# Altium schematic sheet unifying_sht1.SchDoc
size 209 x 297 mm; CheckedBy: Саруханов В.А.; Author: Кузнецов Д.П.; DrawnBy: Кузнецов Д.П.; Revision: 1; SheetNumber: 1; SheetTotal: 2; PageSetup: Record=PageOptions|CenterHorizontal=False|CenterVertical=False|PrintScale=0.95|XCorrection=0.00|YCorrection=0.00|PrintKind=1|BorderSize=5000000|LeftOffset=0|BottomOffset=0|Orientation=1|PaperLength=1000|PaperWidth=1000|Scale=100|PaperSource=15|PrintQuality=600|MediaType=1|DitherType=10|PaperKind=A4|PrintScaleMode=1; Scale: {Масш.}; Title1str: Объединительная; Title2str: плата; ProcessInspection: {Т.контр.}
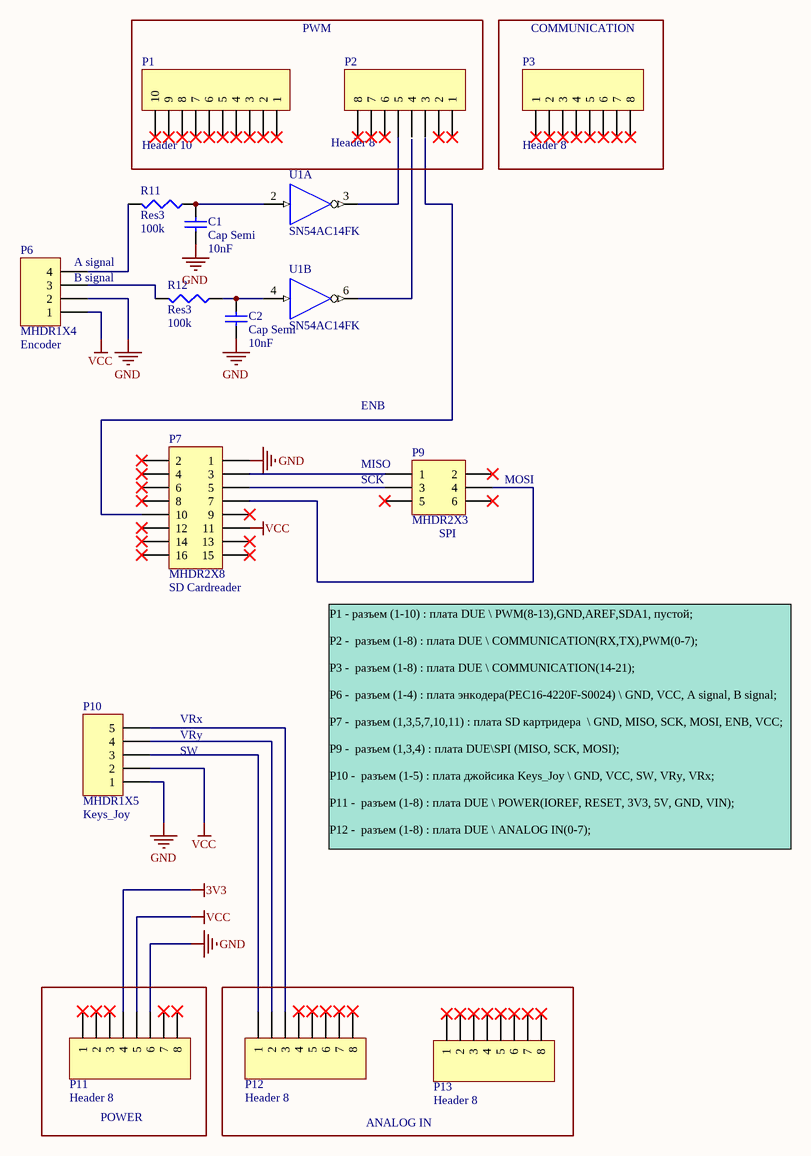
[diagram p0: unifying_sht1.SchDoc]

## Parts
C1  Cap Semi  value 10nF  [C1206]
C2  Cap Semi  value 10nF  [C1206]
P1  Header 10  [HDR1X10]
P2  Header 8  [HDR1X8]
P3  Header 8  [HDR1X8]
P6  MHDR1X4  [MHDR1X4]
P7  MHDR2X8  [MHDR2X8]
P9  MHDR2X3  [MHDR2X3]
P10  MHDR1X5  [MHDR1X5]
P11  Header 8  [HDR1X8]
P12  Header 8  [HDR1X8]
P13  Header 8  [HDR1X8]
R11  Res3  value 100k  [J1-0603]
R12  Res3  value 100k  [J1-0603]
U1  SN54AC14FK  [FK020]  (parts A,B of 6)

## Blocks framed on the sheet
PWM: P1 P2
COMMUNICATION: P3
POWER: P11
ANALOG IN: P12 P13

## Nets
3V3: P11.4
GND: C1.1 C2.1 P6.2 P7.1 P10.1 P11.6 U1.10(GND)
VCC: P6.1 P7.11 P10.2 P11.5 U1.20(VCC)
NetC1_2: C1.2 R11.1 U1.2(A)
NetC2_2: C2.2 R12.1 U1.4(A)
NetP2_5: P2.5 U1.3(Y)
NetP6_3: P6.3 R12.2
NetP6_4: P6.4 R11.2
NetP7_3: P7.3 P9.1
NetP7_5: P7.5 P9.3
NetP7_7: P7.7 P9.4
NetP10_3: P10.3 P12.1
NetP10_4: P10.4 P12.2
NetP10_5: P10.5 P12.3

Not connected (* = marked no-connect by the designer): P1 1* 2* 3* 4* 5* 6* 7* 8* 9* 10*; P2 1* 2* 3 4 6* 7* 8*; P3 1* 2* 3* 4* 5* 6* 7* 8*; P7 2* 4* 6* 8* 9* 10 12* 13* 14* 15* 16*; P9 2* 5* 6*; P11 1* 2* 3* 7* 8*; P12 4* 5* 6* 7* 8*; P13 1* 2* 3* 4* 5* 6* 7* 8*; U1 6(Y)

## Notes on the sheet
- (near P6) A signal
- (near P6) B signal
- ENB
- (near P9) MISO
- (near P9) SCK
- (near P9) MOSI
- VRx
- VRy
- SW
- Р1 - разъем (1-10) : плата DUE \ PWM(8-13),GND,AREF,SDA1, пустой;
  Р2 -  разъем (1-8) : плата DUE \ COMMUNICATION(RX,TX),PWM(0-7);
  Р3 -  разъем (1-8) : плата DUE \ COMMUNICATION(14-21);
  Р6 -  разъем (1-4) : плата энкодера(PEC16-4220F-S0024) \ GND, VCC, A signal, B signal;
  Р7 -  разъем (1,3,5,7,10,11) : плата SD картридера  \ GND, MISO, SCK, MOSI, ENB, VCC;
  Р9 -  разъем (1,3,4) : плата DUE\SPI (MISO, SCK, MOSI);
  Р10 -  разъем (1-5) : плата джойсика Keys_Joy \ GND, VCC, SW, VRy, VRx;
  Р11 -  разъем (1-8) : плата DUE \ POWER(IOREF, RESET, 3V3, 5V, GND, VIN);
  Р12 -  разъем (1-8) : плата DUE \ ANALOG IN(0-7);
  Р13 -  разъем (1-8) : плата DUE \ ANALOG IN(8-11, DAC0, DAC1,CANRX, CANTX);
- Перв. примен.
- Справ. №
- Подп. и дата
- Инв. № дубл.
- Взам. инв. №
- Пров.
- Разраб.
- Изм.
- Лист
- № докум.
- Подп.
- Дата
- Лит.
- Листов
- Инв. № подл.
- Н.контр.
- Утв.
- (in symbol MHDR1X4) Encoder
- (in symbol MHDR1X5) Keys_Joy
- (in symbol MHDR2X3) SPI
- (in symbol MHDR2X8) SD Cardreader

## Library data of the parts
C1 C2 = Cap Semi: Capacitor (Semiconductor SIM Model); Published: 8-Jun-2000; LatestRevisionDate: 29-May-2009; LatestRevisionNote: IPC-7351 Footprint Added.; PackageReference: C1206; Publisher: Altium Limited; PackageDescription: Chip Capacitor
P1 = Header 10: Header, 10-Pin; LatestRevisionDate: 17-Jul-2002; LatestRevisionNote: Re-released for DXP Platform.; Publisher: Altium Limited
P2 P3 P11-P13 = Header 8: Header, 8-Pin; LatestRevisionDate: 17-Jul-2002; LatestRevisionNote: Re-released for DXP Platform.; Publisher: Altium Limited
P6 = MHDR1X4: Header, 4-Pin; LatestRevisionDate: 17-Jul-2002; LatestRevisionNote: Re-released for DXP Platform.; Publisher: Altium Limited
P7 = MHDR2X8: Header, 8-Pin, Dual row; LatestRevisionDate: 17-Jul-2002; LatestRevisionNote: Re-released for DXP Platform.; Publisher: Altium Limited
P9 = MHDR2X3: Header, 3-Pin, Dual row; LatestRevisionDate: 17-Jul-2002; LatestRevisionNote: Re-released for DXP Platform.; Publisher: Altium Limited
P10 = MHDR1X5: Header, 5-Pin; LatestRevisionDate: 17-Jul-2002; LatestRevisionNote: Re-released for DXP Platform.; Publisher: Altium Limited
R11 R12 = Res3: Resistor; Published: 8-Jun-2000; LatestRevisionDate: 29-May-2009; LatestRevisionNote: IPC-7351 Footprint Added.; PackageReference: J1-0603; Publisher: Altium Limited; PackageDescription: Chip Resistor
U1 = SN54AC14FK: Hex Schmitt-Trigger Inverter; Note: Pins 1, 5, 7, 11, 15 and 17 are not connected and not drawn; Published: 8-Jun-2000; LatestRevisionDate: 17-Jul-2002; LatestRevisionNote: Re-released for DXP Platform.; DatasheetVersion: Feb-1998; PackageVersion: 1998; PackageReference: FK020; Publisher: Altium Limited; PackageDescription: Leadless Chip Carrier; 20 Terminals; Body 8.9 x 8.9 mm; ComponentLink1Description: Manufacturer Link; ComponentLink1URL: http://www.ti.com/; ComponentLink2Description: Datasheet; ComponentLink2URL: http://www-s.ti.com/sc/ds/sn54ac14.pdf; ComponentLink3Description: Packaging Specification; ComponentLink3URL: http://www-s.ti.com/sc/psheets/mlcc006b/mlcc006b.pdf